# EasyEDA schematic SCH_sweeping-mesuring-device V2_2022-12-07.json
TITLE: SWEEPING MESURING DEVICE; REV: 2.0; Date: 2022-02-24; Sheet: 1/1; Drawn By: frigi; Company: www.frigi.ch
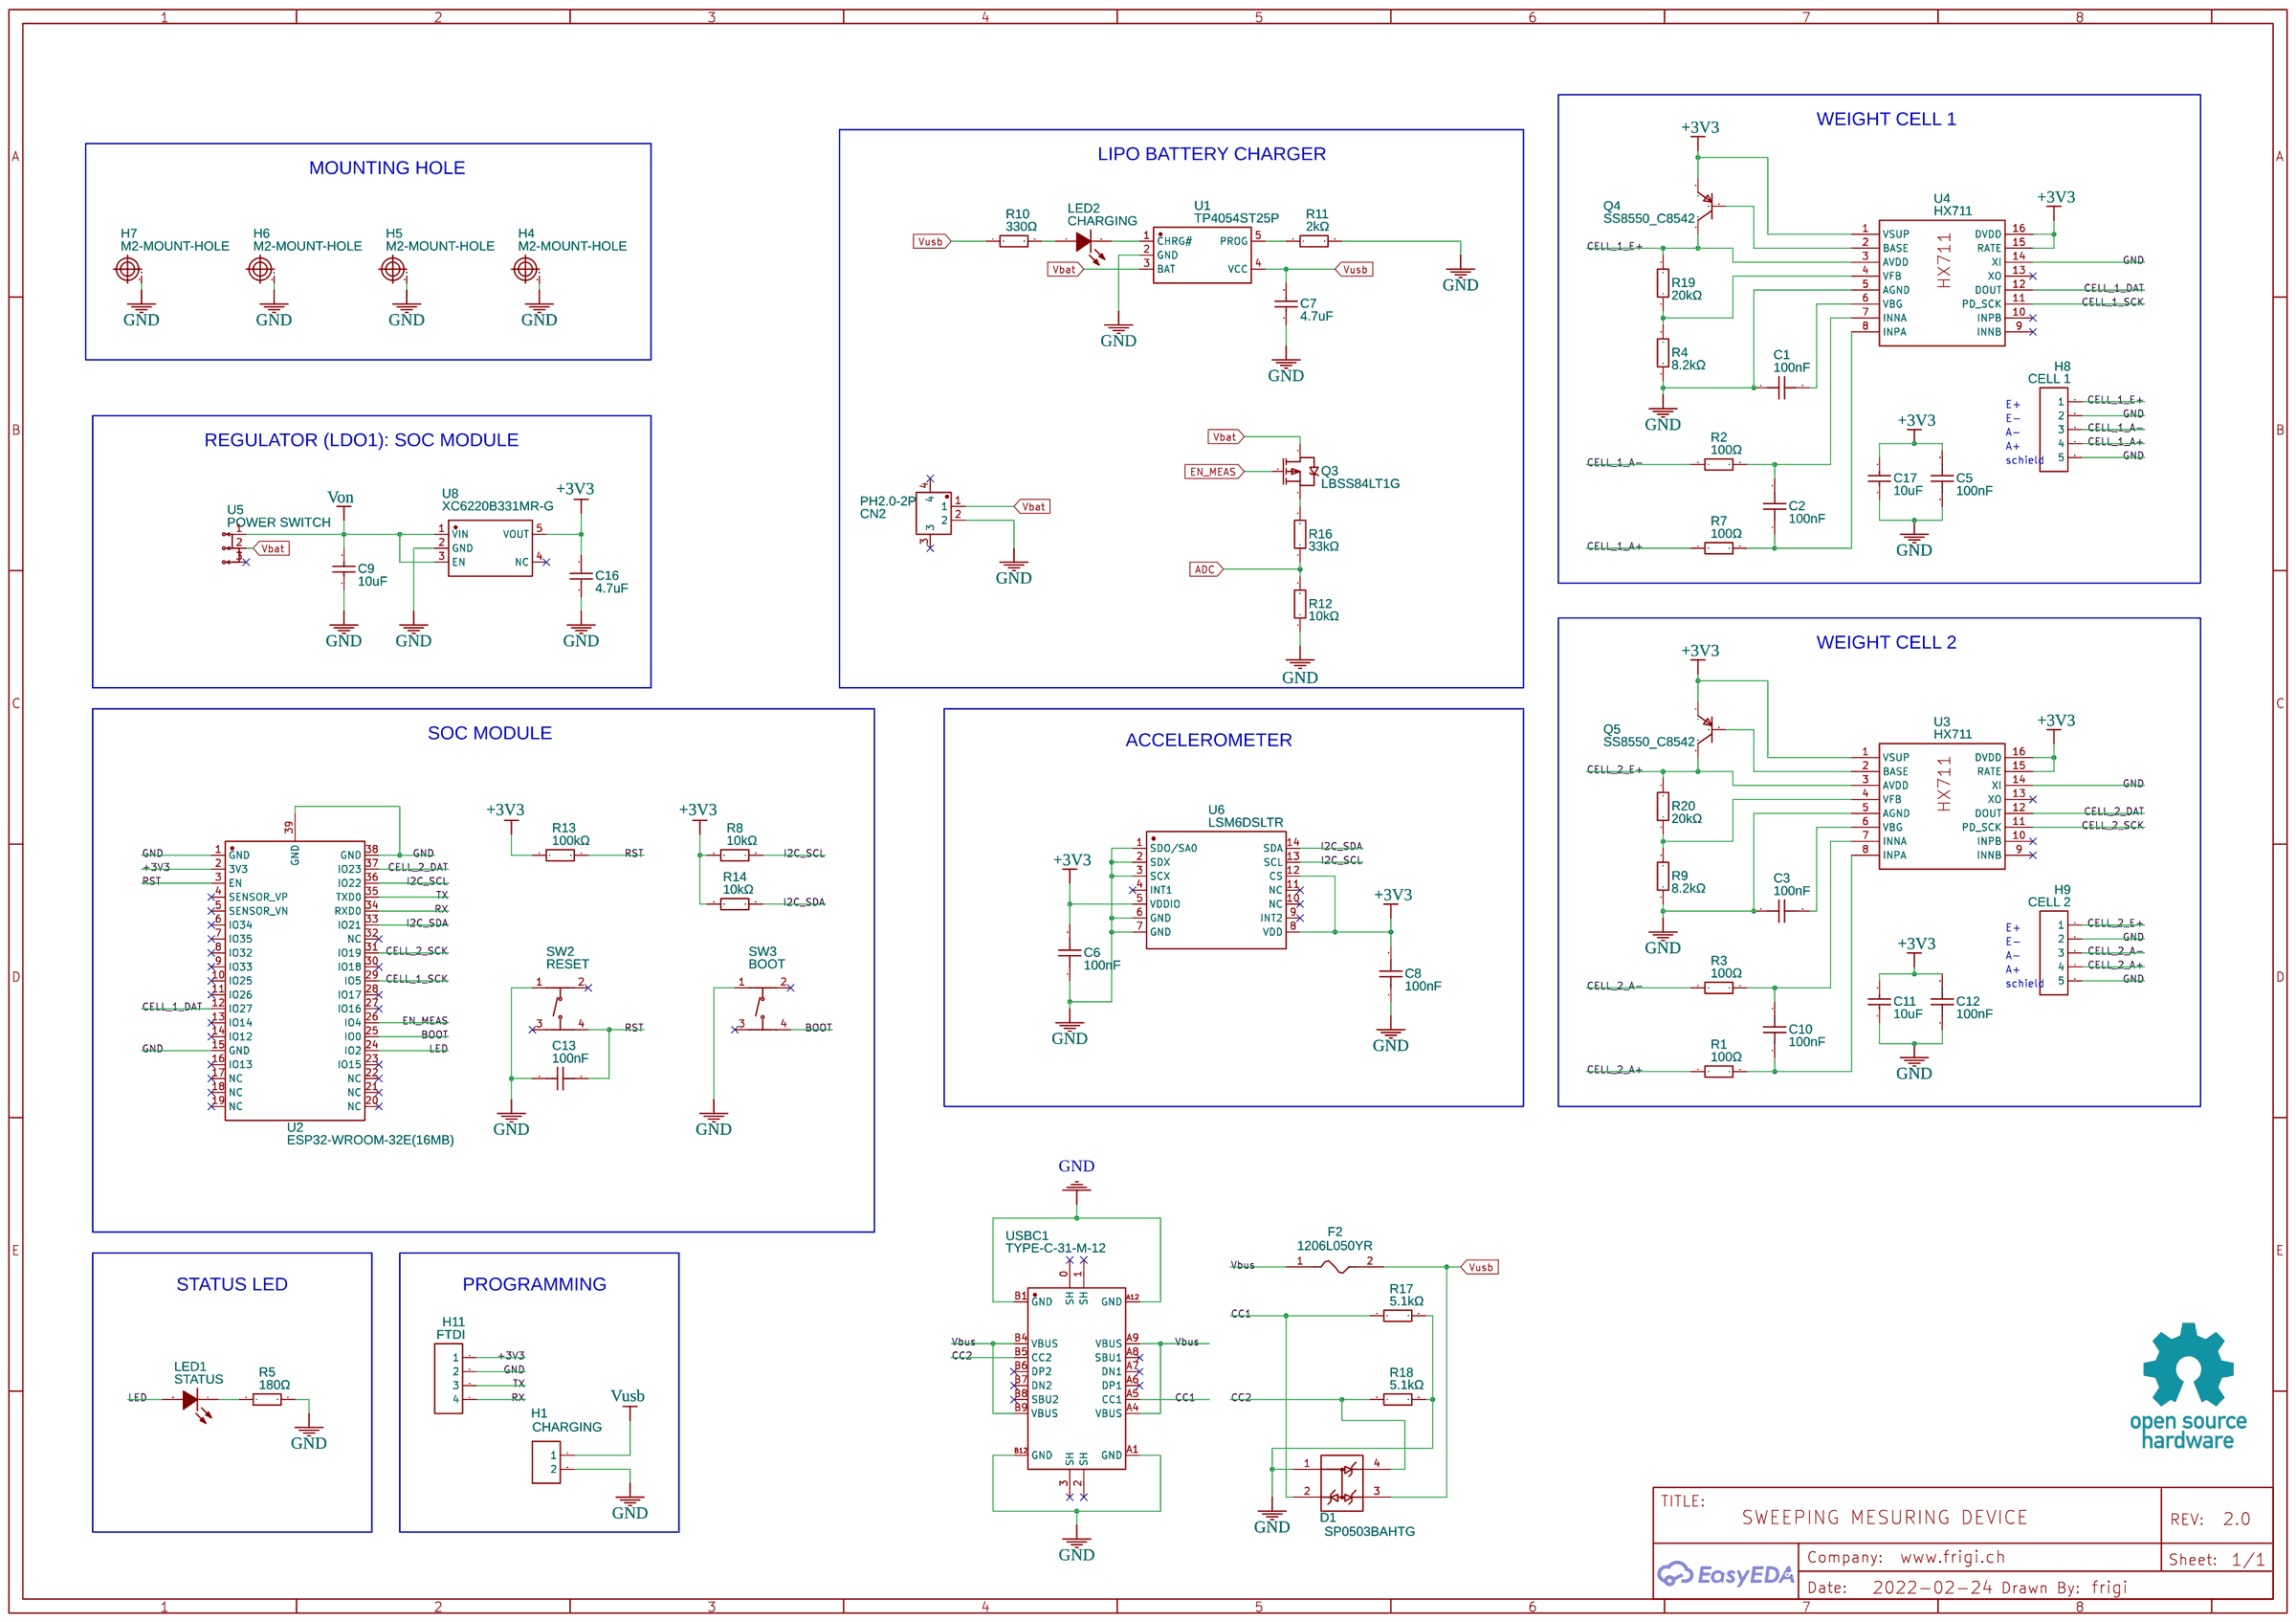
[diagram p0: schematic sheet]

## Parts
C1  100nF  [C0603]
C2  100nF  [C0603]
C3  100nF  [C0603]
C5  100nF  [C0603]
C6  100nF  [C0603]
C7  4.7uF  [C0805]
C8  100nF  [C0603]
C9  10uF  [C0805]
C10  100nF  [C0603]
C11  10uF  [C0805]
C12  100nF  [C0603]
C13  100nF  [C0603]
C16  4.7uF  [C0805]
C17  10uF  [C0805]
CN2  PH2.0-2P  [CONN-SMD_PH2.0-1X2PW]
D1  SP0503BAHTG  [SOT-143_L2.9-W1.3-P1.92-LS2.3-BR]
F2  1206L050YR  [F1206]
H1  CHARGING  [HDR-F-2.54_1X2]
H4  M2-MOUNT-HOLE  [M2-MOUNT-HOLE]
H5  M2-MOUNT-HOLE  [M2-MOUNT-HOLE]
H6  M2-MOUNT-HOLE  [M2-MOUNT-HOLE]
H7  M2-MOUNT-HOLE  [M2-MOUNT-HOLE]
H8  CELL 1  [HDR-F-2.54_1X5]
H9  CELL 2  [HDR-F-2.54_1X5]
H11  FTDI  [HDR-F-2.54_1X4]
LED1  STATUS  [LED0805-RD]
LED2  CHARGING  [LED0805-RD]
Q3  LBSS84LT1G  [SOT-23_L2.9-W1.3-P1.90-LS2.4-BR]
Q4  SS8550_C8542  [SOT-23-3_L2.9-W1.3-P1.90-LS2.4-BR]
Q5  SS8550_C8542  [SOT-23-3_L2.9-W1.3-P1.90-LS2.4-BR]
R1  100Ω  [R0402]
R2  100Ω  [R0402]
R3  100Ω  [R0402]
R4  8.2kΩ  [R0603]
R5  180Ω  [R0603]
R7  100Ω  [R0402]
R8  10kΩ  [R0603]
R9  8.2kΩ  [R0603]
R10  330Ω  [R0603]
R11  2kΩ  [R0603]
R12  10kΩ  [R0603]
R13  100kΩ  [R0603]
R14  10kΩ  [R0603]
R16  33kΩ  [R0603]
R17  5.1kΩ  [R0603]
R18  5.1kΩ  [R0603]
R19  20kΩ  [R0603]
R20  20kΩ  [R0603]
SW2  RESET  [SW-SMD_4P-L5.1-W5.1-P3.70-LS6.5-TL-2]
SW3  BOOT  [SW-SMD_4P-L5.1-W5.1-P3.70-LS6.5-TL-2]
U1  TP4054ST25P  [SOT-23-5_L2.9-W1.6-P0.95-LS2.8-BL]
U2  ESP32-WROOM-32E(16MB)  [WIFI-SMD_ESP32-WROOM-32E]
U3  HX711  [SOP-16_L10.0-W3.9-P1.27-LS6.0-BL]
U4  HX711  [SOP-16_L10.0-W3.9-P1.27-LS6.0-BL]
U5  POWER SWITCH  [SW-TH_DEALON_SS-12D01-GX]
U6  LSM6DSLTR  [LGA-14_L3.0-W2.5-P0.50-TL]
U8  XC6220B331MR-G  [TSOT-23-5_L2.9-W1.6-P0.95-LS2.8-BL]
USBC1  TYPE-C-31-M-12  [USB-C_SMD-TYPE-C-31-M-12]

## Library data of the parts
C1-C3 C5 C6 C8 C10 C12 C13 = CC0603KRX7R9BB104: Supplier: LCSC; Manufacturer: YAGEO(国巨); Supplier Part: C14663; JLCPCB Part Class: Basic Part
C7 C16 = CL21A475KAQNNNE: Supplier: LCSC; Manufacturer: SAMSUNG(三星); Supplier Part: C1779; JLCPCB Part Class: Basic Part
C9 C11 C17 = CL21A106KAYNNNE: Supplier: LCSC; Manufacturer: SAMSUNG(三星); Supplier Part: C15850; JLCPCB Part Class: Basic Part
CN2 = PH2.0-2P: Supplier: LCSC; Manufacturer: BOOMELE; Contributor: LCSC; Supplier Part: C64658; JLCPCB Part Class: Extended Part
D1 = SP0503BAHTG: Supplier: LCSC; Manufacturer: Littelfuse(美国力特); Supplier Part: C7074; JLCPCB Part Class: Extended Part
F2 = nSMD050: Supplier: LCSC; Manufacturer: 台湾陆海; image: //image.lceda.cn/szlcsc/C69688.jpg; Supplier Part: C69688; SMT Type: Extend; JLCPCB SMD: Yes; JLCPCB Part Class: Extended Part
H1 = HDR-F-2.54_1x2: Supplier Part: C49661; Supplier: LCSC; Contributor: LCEDA_Lib
H4-H7 = M2-MOUNT-HOLE: Contributor: adamalfath
H8 H9 = HDR-F-2.54_1x5: Supplier Part: C50950; Supplier: LCSC; Contributor: LCEDA_Lib
H11 = HDR-F-2.54_1x4: Supplier Part: C225501; Supplier: LCSC; Contributor: LCEDA_Lib
LED1 LED2 = 17-21SUYC/TR8: Supplier: LCSC; Manufacturer: null; Manufacturer Part: KT-0805黄灯 (SMT业务专用); Supplier Part: C2296; JLCPCB Part Class: Basic Part
Q3 = LBSS84LT1G: Supplier: LCSC; Manufacturer: LRC(乐山无线电); Supplier Part: C8492; JLCPCB Part Class: Basic Part
Q4 Q5 = SS8550_C8542: Supplier: LCSC; Manufacturer: CJ(江苏长电/长晶); Manufacturer Part: SS8550 Y2; Supplier Part: C8542; JLCPCB Part Class: Basic Part
R1-R3 R7 = 0402WGF1000TCE: Supplier: LCSC; Manufacturer: UNI-ROYAL(厚声); Supplier Part: C25076; Resistance (Ohms): 100; JLCPCB Part Class: Basic Part
R4 R9 = 0603WAF8201T5E: Supplier: LCSC; Manufacturer: UNI-ROYAL(厚声); Supplier Part: C25981; Resistance (Ohms): 8.2K; JLCPCB Part Class: Basic Part
R5 = 0603WAF1800T5E: Supplier: LCSC; Manufacturer: UNI-ROYAL(厚声); Supplier Part: C22828; Resistance (Ohms): 180; JLCPCB Part Class: Basic Part
R8 R12 R14 = 0603WAF1002T5E: Supplier: LCSC; Manufacturer: UniOhm; Supplier Part: C25804; Resistance (Ohms): 10K; JLCPCB Part Class: Basic Part
R10 = 0603WAF3300T5E: Supplier: LCSC; Manufacturer: UNI-ROYAL(厚声); Supplier Part: C23138; Resistance (Ohms): 330; JLCPCB Part Class: Basic Part
R11 = 0603WAF2001T5E: Supplier: LCSC; Manufacturer: UNI-ROYAL(厚声); Supplier Part: C22975; Resistance (Ohms): 2K; JLCPCB Part Class: Basic Part
R13 = 0603WAF1003T5E: Supplier: LCSC; Manufacturer: UNI-ROYAL(厚声); Supplier Part: C25803; Resistance (Ohms): 100K; JLCPCB Part Class: Basic Part
R16 = 0603WAF3302T5E: Supplier: LCSC; Manufacturer: UniOhm; Supplier Part: C4216; Resistance (Ohms): 33K; JLCPCB Part Class: Basic Part
R17 R18 = 0603WAF5101T5E: Supplier: LCSC; Manufacturer: UNI-ROYAL(厚声); Supplier Part: C23186; Resistance (Ohms): 5.1K; JLCPCB Part Class: Basic Part
R19 R20 = 0603WAF2002T5E: Supplier: LCSC; Manufacturer: UniOhm; Supplier Part: C4184; Resistance (Ohms): 20K; JLCPCB Part Class: Basic Part
SW2 SW3 = TS-1187A-B-A-B: Supplier: LCSC; Supplier Part: C318884; Manufacturer: XKB Connectivity(中国星坤); Contributor: LCSC; JLCPCB Part Class: Basic Part
U1 = TP4054ST25P: Supplier: LCSC; Supplier Part: C382138; Manufacturer: TPOWER(天源); Manufacturer Part: TP4054ST25K; Contributor: LCSC; JLCPCB Part Class: Extended Part
U2 = ESP32-WROOM-32E(16MB): Supplier: LCSC; Supplier Part: C701343; Manufacturer: ESPRESSIF(乐鑫); Contributor: LCSC; JLCPCB Part Class: Extended Part
U3 U4 = HX711: Supplier: LCSC; Manufacturer: AVIA(海芯科技); Supplier Part: C43656; JLCPCB Part Class: Extended Part
U5 = SS-12D01-G3_C2998803: Supplier: LCSC; Supplier Part: C2998803; Manufacturer: DEALON(德艺隆); Manufacturer Part: SS-12D01-G3; link: https://atta.szlcsc.com/upload/public/pdf/source/20220425/25A884465C8B20C5829C01117852840B.pdf; Contributor: lcsc; JLCPCB Part Class: Extended Part
U6 = LSM6DSLTR: Supplier: LCSC; Manufacturer: ST(意法半导体); Contributor: LCSC; Supplier Part: C126672; JLCPCB Part Class: Extended Part
U8 = RT9080-33GJ5: Supplier: LCSC; Supplier Part: C841192; Manufacturer: RICHTEK(台湾立锜); Contributor: LCSC; JLCPCB Part Class: Extended Part
USBC1 = TYPE-C-31-M-12: Supplier: LCSC; Supplier Part: C165948; Manufacturer: 韩国韩荣; Contributor: LCSC; JLCPCB Part Class: Extended Part

## Nets
+3V3: C5.2 C6.2 C8.2 C11.2 C12.2 C16.2 C17.2 H11.1 Q4.2(E) Q5.2(E) R8.2 R13.1 R14.2 U2.2(3V3) U3.1(VSUP) U3.15(RATE) U3.16(DVDD) U4.1(VSUP) U4.15(RATE) U4.16(DVDD) U6.5(VDDIO) U6.8(VDD) U6.12(CS) U8.5(VOUT)
GND: C1.1 C3.1 C5.1 C6.1 C7.1 C8.1 C9.1 C11.1 C12.1 C13.1 C16.1 C17.1 CN2.2 D1.1 H1.2 H4.1(GND) H5.1(GND) H6.1(GND) H7.1(GND) H8.2 H8.5 H9.2 H9.5 H11.2 R4.1 R5.2 R9.1 R11.2 R12.1 R17.2 R18.2 SW2.1(A) SW3.1(A) U1.2(GND) U2.1(GND) U2.15(GND) U2.38(GND) U2.39(GND) U3.5(AGND) U3.14(XI) U4.5(AGND) U4.14(XI) U6.1(SDO/SA0) U6.2(SDX) U6.3(SCX) U6.6(GND) U6.7(GND) U8.2(GND) USBC1.A1(GND) USBC1.A12(GND) USBC1.B1(GND) USBC1.B12(GND)
Vbat: CN2.1 Q3.3(D) U1.3(BAT) U5.2
Vbus: F2.1 USBC1.A4(VBUS) USBC1.A9(VBUS) USBC1.B4(VBUS) USBC1.B9(VBUS)
ADC: R12.2 R16.1
BOOT: SW3.4(D) U2.25(IO0)
CC1: D1.2 R17.1 USBC1.A5(CC1)
CC2: D1.4 R18.1 USBC1.B5(CC2)
CELL_1_A+: H8.4 R7.1
CELL_1_A-: H8.3 R2.1
CELL_1_DAT: U2.12(IO27) U4.12(DOUT)
CELL_1_E+: H8.1 Q4.3(C) R19.2 U4.3(AVDD)
CELL_1_SCK: U2.29(IO5) U4.11(PD_SCK)
CELL_2_A+: H9.4 R1.1
CELL_2_A-: H9.3 R3.1
CELL_2_DAT: U2.37(IO23) U3.12(DOUT)
CELL_2_E+: H9.1 Q5.3(C) R20.2 U3.3(AVDD)
CELL_2_SCK: U2.31(IO19) U3.11(PD_SCK)
EN_MEAS: Q3.1(G) U2.26(IO4)
I2C_SCL: R8.1 U2.36(IO22) U6.13(SCL)
I2C_SDA: R14.1 U2.33(IO21) U6.14(SDA)
LED: LED1.2(+) U2.24(IO2)
RST: C13.2 R13.2 SW2.4(D) U2.3(EN)
RX: H11.4 U2.34(RXD0)
TX: H11.3 U2.35(TXD0)
Von: C9.2 U5.1 U8.1(VIN) U8.3(EN)
Vusb: C7.2 D1.3 F2.2 H1.1 R10.1 U1.4(VCC)
Net-(C1-2): C1.2 U4.6(VBG)
Net-(C2-1): C2.1 R7.2 U4.8(INPA)
Net-(C2-2): C2.2 R2.2 U4.7(INNA)
Net-(C3-2): C3.2 U3.6(VBG)
Net-(C10-1): C10.1 R1.2 U3.8(INPA)
Net-(C10-2): C10.2 R3.2 U3.7(INNA)
Net-(LED1-1): LED1.1(-) R5.1
Net-(LED2-1): LED2.1(-) U1.1(CHRG#)
Net-(LED2-2): LED2.2(+) R10.2
Net-(Q3-2): Q3.2(S) R16.2
Net-(Q4-1): Q4.1(B) U4.2(BASE)
Net-(Q5-1): Q5.1(B) U3.2(BASE)
Net-(R4-2): R4.2 R19.1 U4.4(VFB)
Net-(R9-2): R9.2 R20.1 U3.4(VFB)
Net-(R11-1): R11.1 U1.5(PROG)

Not connected (* = marked no-connect by the designer): CN2 3* 4*; SW2 2(B)* 3(C)*; SW3 2(B)* 3(C)*; U2 4(SENSOR_VP)* 5(SENSOR_VN)* 6(IO34)* 7(IO35)* 8(IO32)* 9(IO33)* 10(IO25)* 11(IO26)* 13(IO14)* 14(IO12)* 16(IO13)* 17(NC)* 18(NC)* 19(NC)* 20(NC)* 21(NC)* 22(NC)* 23(IO15)* 27(IO16)* 28(IO17)* 30(IO18)* 32(NC)*; U3 9(INNB)* 10(INPB)* 13(XO)*; U4 9(INNB)* 10(INPB)* 13(XO)*; U5 3*; U6 4(INT1)* 9(INT2)* 10(NC)* 11(NC)*; U8 4(NC)*; USBC1 0(SH)* 1(SH)* 2(SH)* 3(SH)* A6(DP1)* A7(DN1)* A8(SBU1)* B6(DP2)* B7(DN2)* B8(SBU2)*

## Notes on the sheet
- WEIGHT CELL 1
- MOUNTING HOLE
- LIPO BATTERY CHARGER
- E+
- A-
- E-
- REGULATOR (LDO1): SOC MODULE
- A+
- schield
- WEIGHT CELL 2
- SOC MODULE
- ACCELEROMETER
- E+
- E-
- A-
- A+
- schield
- STATUS LED
- PROGRAMMING
